# EAGLE design control (EAGLE 9.0.0)
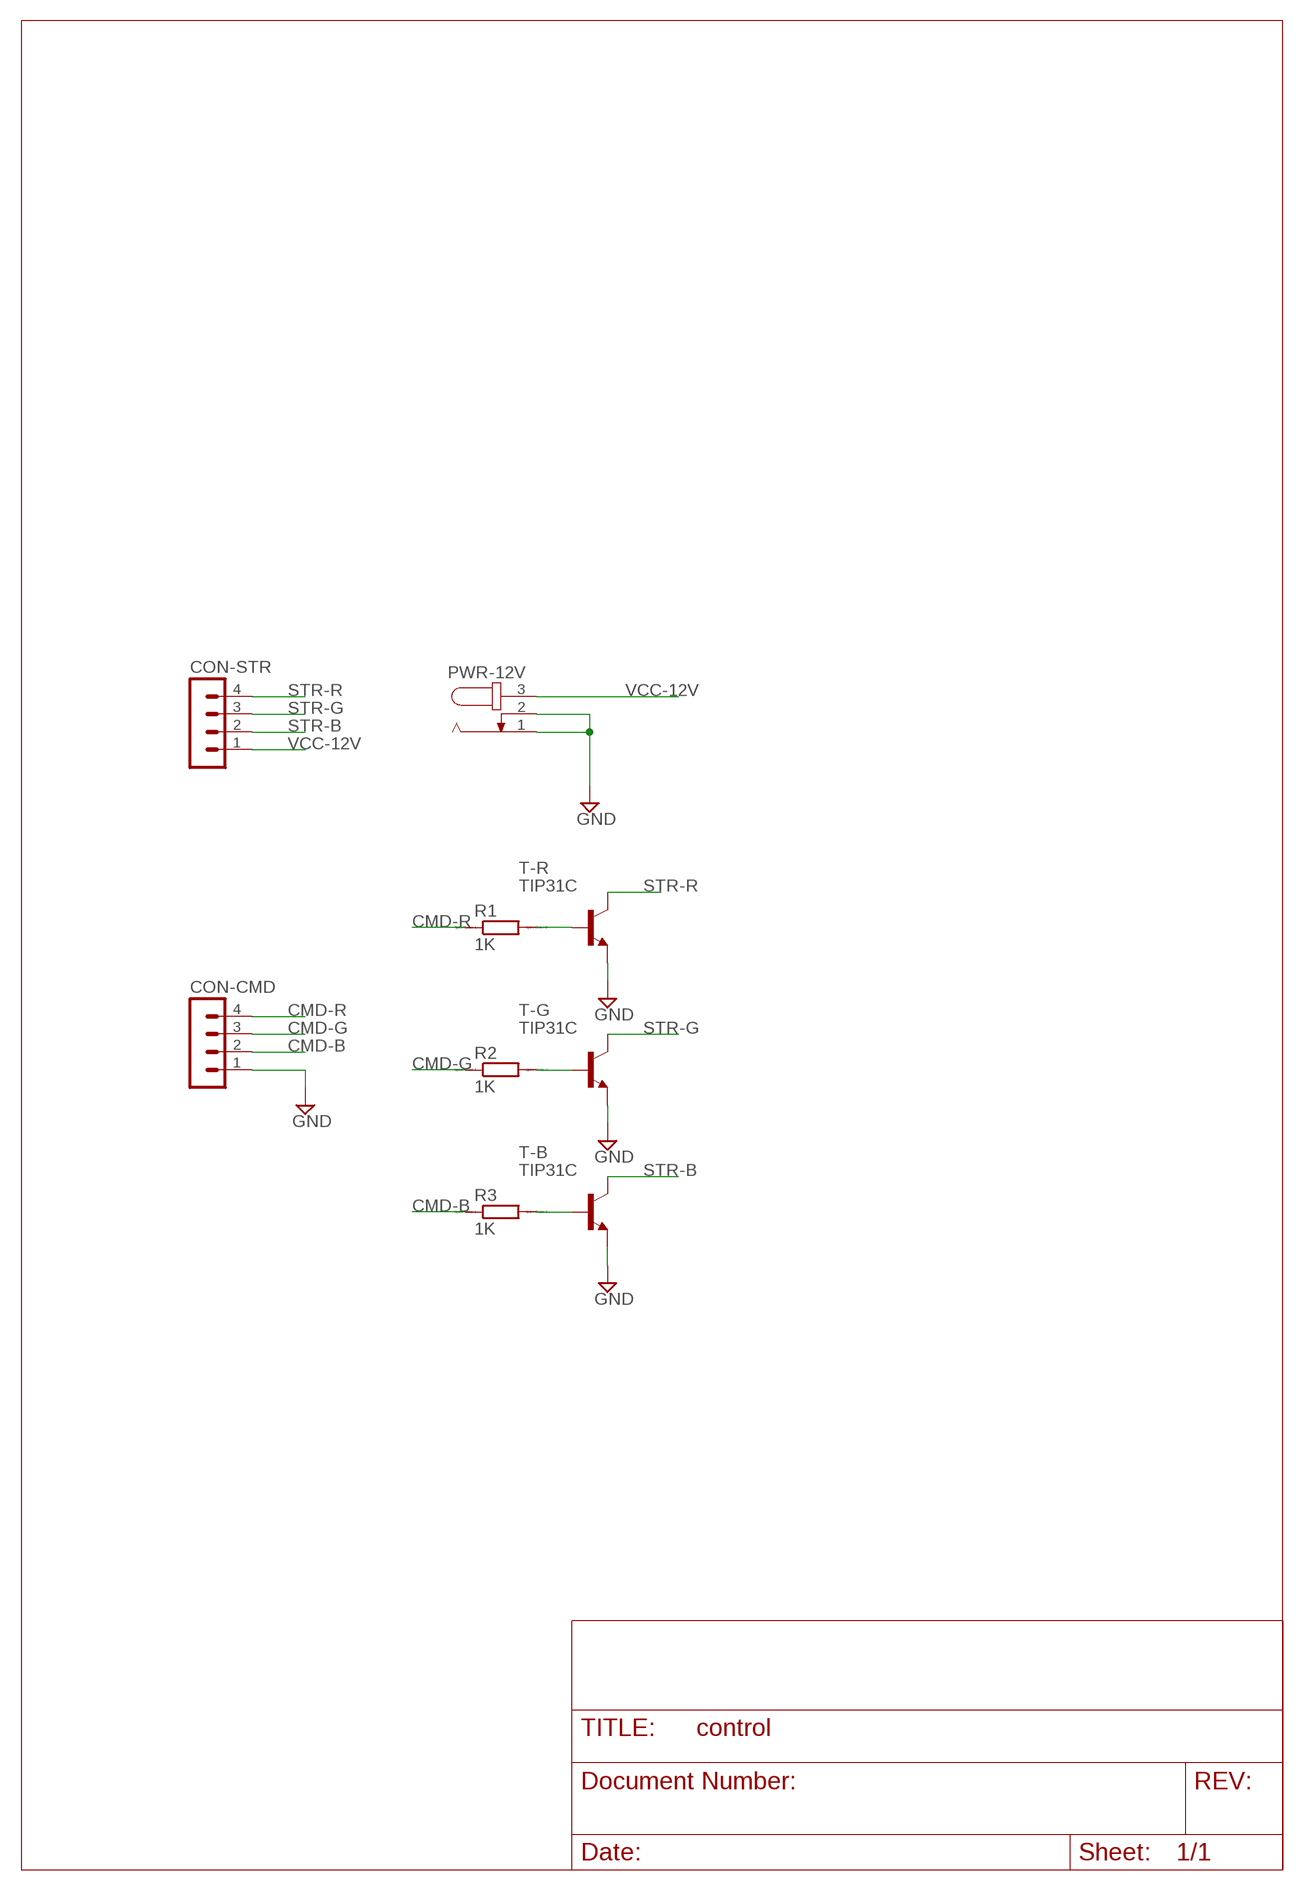
[diagram p0: schematic, sheet 1]

## Parts
CON-CMD  MA04-1  [MA04-1]
CON-STR  MA04-1  [MA04-1]
PWR-12V  JACK-PLUG0  [SPC4077]
R1  1K  R0207/10  [0207/10]
R2  1K  R0207/10  [0207/10]
R3  1K  R0207/10  [0207/10]
T-B  TIP31C  [TO220]
T-G  TIP31C  [TO220]
T-R  TIP31C  [TO220]

## Nets
CMD-B: CON-CMD.2 R3.1
CMD-G: CON-CMD.3 R2.1
CMD-R: CON-CMD.4 R1.1
GND: CON-CMD.1 PWR-12V.1 PWR-12V.2 T-B.3(E) T-G.3(E) T-R.3(E)
N$1: R1.2 T-R.1(B)
N$2: R2.2 T-G.1(B)
N$3: R3.2 T-B.1(B)
STR-B: CON-STR.2 T-B.2(C)
STR-G: CON-STR.3 T-G.2(C)
STR-R: CON-STR.4 T-R.2(C)
VCC-12V: CON-STR.1 PWR-12V.3

## Library data of the parts
CON-CMD CON-STR = con-lstb:MA04-1: PIN HEADER; OC_FARNELL: unknown; OC_NEWARK: unknown
PWR-12V = con-jack:JACK-PLUG: DC POWER JACK Power Jack, DC, Right Angle, Through Hole, Rated 5A at 16VDC, PC Terminals Distributor: Farnell (www.Farnell.de) Drawing: 84N1161.pdf / 84N1162.pdf Manufacturer: SPC Technology (www.spctechnology.com) Type: SPC4077 / SPC 4078; OC_FARNELL: unknown; OC_NEWARK: unknown
R1-R3 = eagle-ltspice:R: RESISTOR, European symbol; SPICEMODEL: NONE; SPICEPREFIX: R
T-B T-G T-R = transistor-neu-to92:TIP31C: NPN TRANSISTOR

## Board
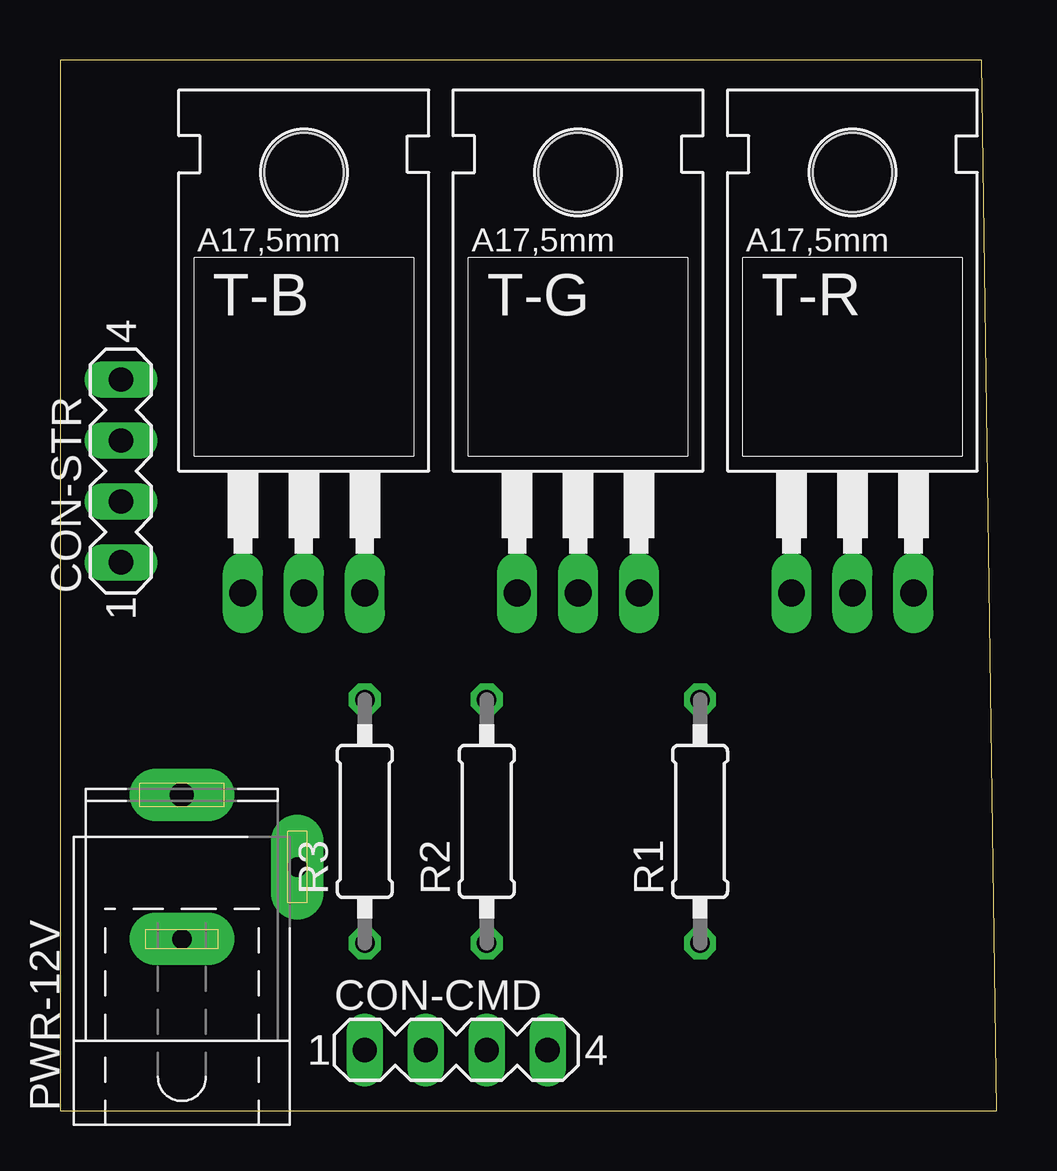
[diagram p1: board, top side]
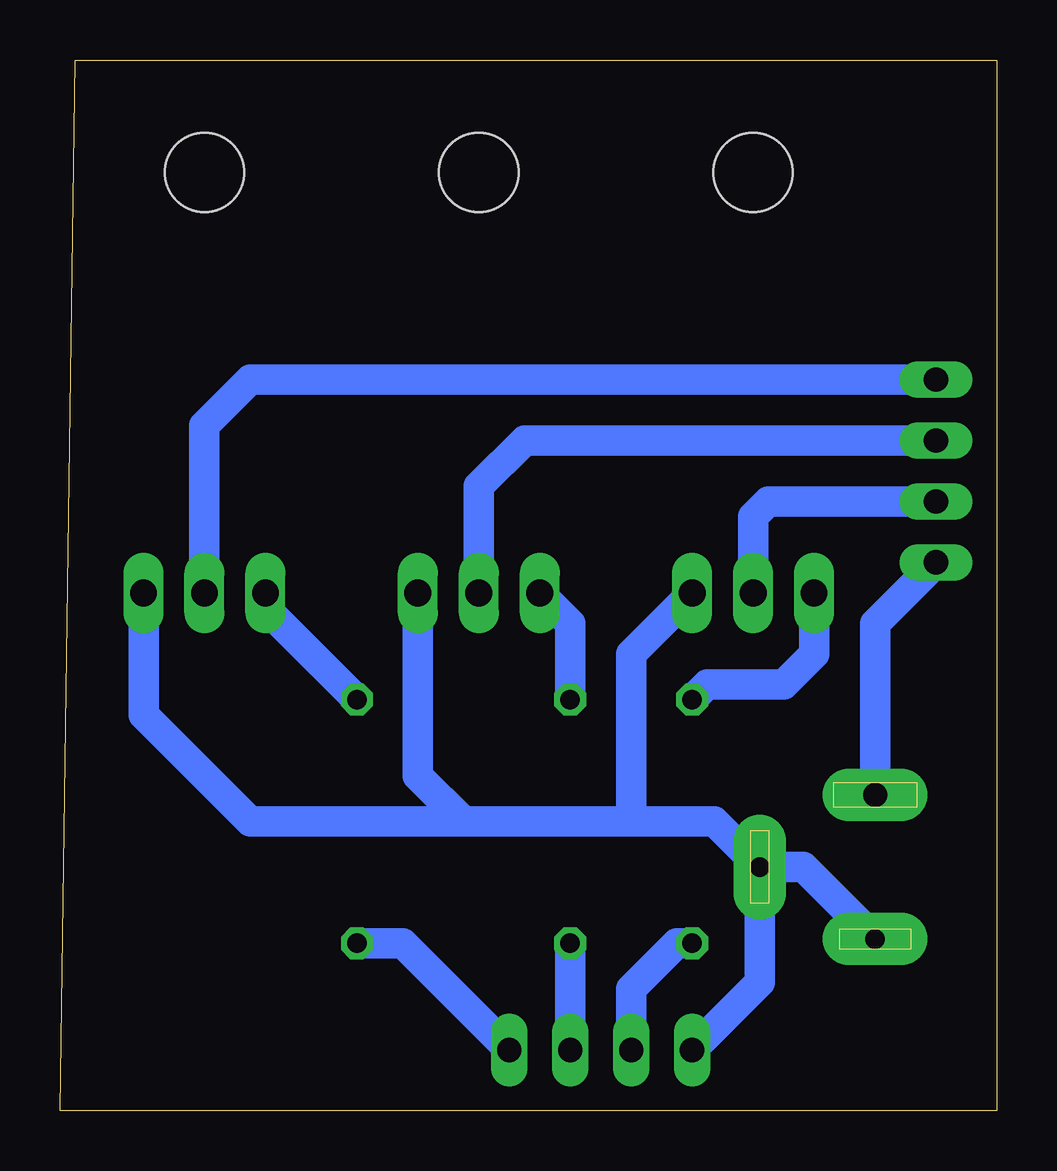
[diagram p2: board, bottom side, seen from below]

Size 39.04 x 43.8 mm. Coordinates in mm from the lower left corner, seen from the top.
Outline: 0,0 39.04,0 38.41,43.8 0,43.8 0,0
Copper layers (1*16): Top 0.035mm / dielectric 1.5mm / Bottom 0.035mm
Design rules "default": minimum track width 6mil, minimum drill 0.35mm, track to track 6mil, track to pad 6mil, pad to pad 6mil, via to via 6mil, smd to smd 6mil, copper to edge 40mil, drill to drill 6mil, minimum pad ring 10mil, minimum via ring 8mil, stop-mask expansion 4mil, vias tented up to drill 0mil, thermal gap 10mil

### Footprints (pad centres in the part's own frame; a part is rotated, then mirrored left to right if it is on the bottom)
MA04-1 = drill 1.016 long: 1 -3.81,0; 2 -1.27,0; 3 1.27,0; 4 3.81,0
SPC4077 = drill 0.8 pad 2.184 long: 1 -3,0; 2 0,-4.8 | drill 1 pad 2.184 long: 3 3,0
0207/10 = drill 0.813 octagon: 1 -5.08,0; 2 5.08,0
TO220 = drill 1.118 long: 1 -2.54,-6.35; 2 0,-6.35; 3 2.54,-6.35 | hole 3.302: 0,11.176

### Placement (x,y rotation side)
CON-CMD  16.51,2.54 0 top
CON-STR  2.54,26.67 90 top
PWR-12V  5.08,10.16 90 top
R1  26.67,12.06 90 top
R2  17.78,12.06 90 top
R3  12.7,12.06 90 top
T-B  10.16,27.94 0 top
T-G  21.59,27.94 0 top
T-R  33.02,27.94 0 top

### Tracks (layer width: path | path; a pad name or v marks a point on that pad's centre or on a via)
CMD-B
  Bottom 1.27: CON-CMD.2 15.24,5.08 13.34,6.99 R3.1
CMD-G
  Bottom 1.27: CON-CMD.3 R2.1
CMD-R
  Bottom 1.27: CON-CMD.4 24.77,6.99 R1.1
GND
  Top 0.254: PWR-12V.1 6.88,7.16
  Bottom 0.254: CON-CMD.1 9.53,5.71 9.53,10.16
  Bottom 1.27: PWR-12V.1 8.08,10.16 9.53,10.16 PWR-12V.2 | PWR-12V.2 11.79,12.06 15.24,12.06 | 15.24,12.06 22.23,12.06 | 22.23,12.06 31.11,12.06 35.56,16.51 T-R.3 | 22.23,12.06 24.13,13.97 T-G.3 | 15.24,12.06 15.24,19.05 T-B.3 | CON-CMD.1 9.88,5.36 PWR-12V.2
N$1
  Bottom 1.27: R1.2 30.48,20.95 T-R.1
N$2
  Bottom 1.27: R2.2 17.78,20.32 T-G.1
N$3
  Bottom 1.27: R3.2 12.06,17.78 8.89,17.78 7.62,19.05 T-B.1
STR-B
  Bottom 1.27: T-B.2 10.16,24.77 9.53,25.4 CON-STR.2
STR-G
  Bottom 1.27: CON-STR.3 13.97,27.94 15.84,27.94 19.68,27.94 21.59,26.04 T-G.2
STR-R
  Bottom 1.27: T-R.2 33.02,28.57 31.11,30.48 CON-STR.4
VCC-12V
  Bottom 1.27: PWR-12V.3 5.08,20.32 CON-STR.1